# EAGLE design SmartWatch-BASIC-Bottom (EAGLE 9.6.2)
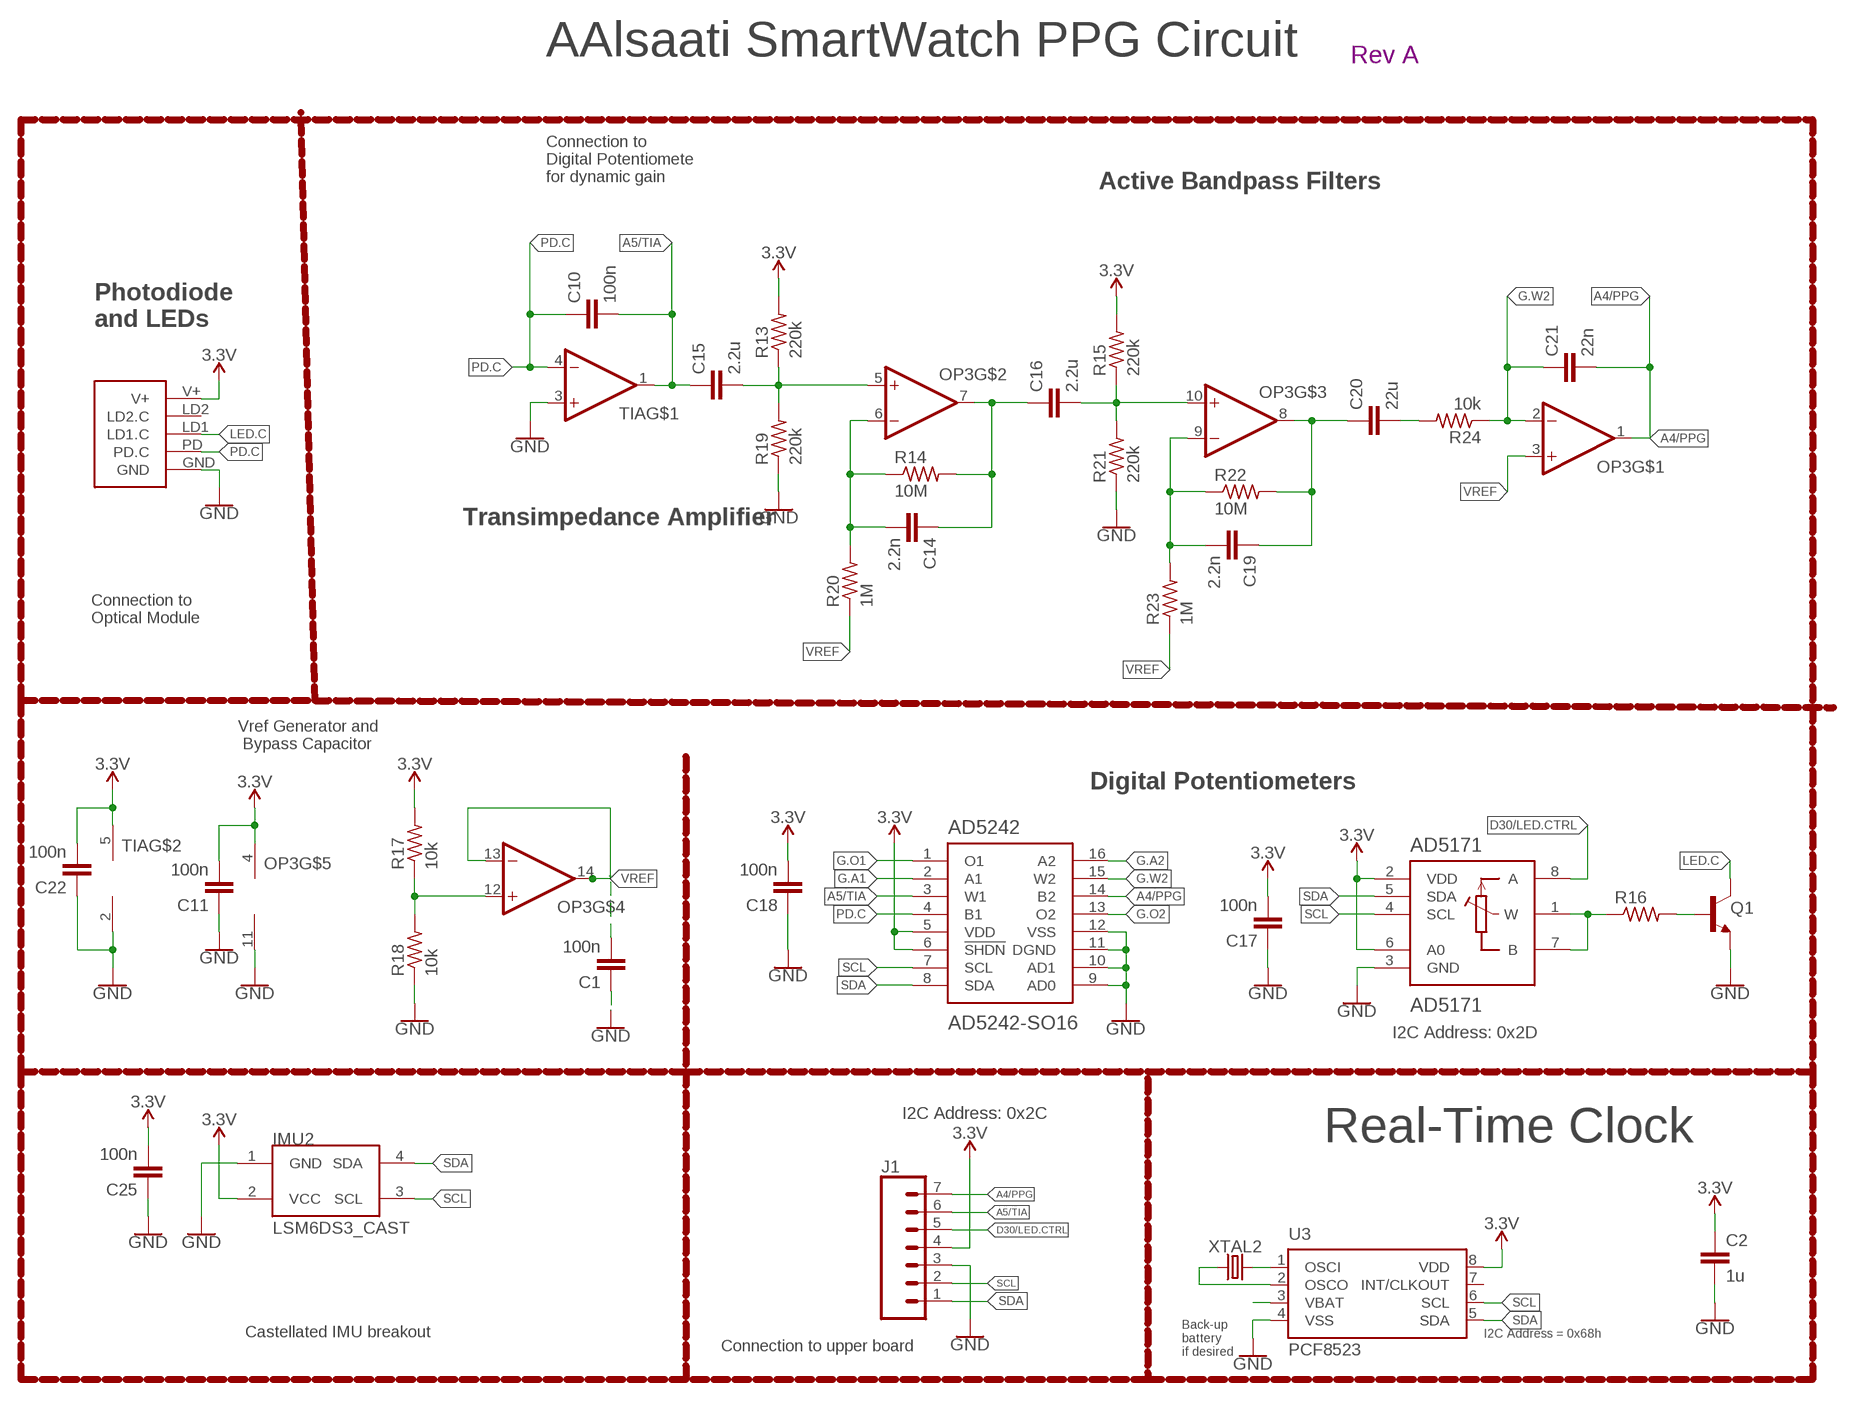
[diagram p0: schematic, sheet 1]

## Parts
AD5171  AD5171  [SOT-23-8]
AD5242  AD5242-SO16  [SO16]
C1  100n  CAPACITOR0603  [C0603]
C2  1u  CAPACITOR0603  [C0603]
C10  100n  CAPACITOR0603  [C0603]
C11  100n  CAPACITOR0603  [C0603]
C14  2.2n  CAPACITOR0603  [C0603]
C15  2.2u  CAPACITOR0603  [C0603]
C16  2.2u  CAPACITOR0603  [C0603]
C17  100n  CAPACITOR0603  [C0603]
C18  100n  CAPACITOR0603  [C0603]
C19  2.2n  CAPACITOR0603  [C0603]
C20  22u  CAPACITOR0603  [C0603]
C21  22n  CAPACITOR0603  [C0603]
C22  100n  CAPACITOR0603  [C0603]
C25  100n  CAPACITOR0603  [C0603]
IMU2  LSM6DS3_CAST  [LSM6DS3_CAST]
J1  CONN_07-1.27MM  [1X07_1.27MM]
LOGO1  REVISION.A  [REV.A]
OP3  OP-QUAD-SO14  [SO14]
Q1  NPN-GENERIC  [SOT23-3]
R13  220k  RESISTOR0603  [R0603]
R14  10M  RESISTOR0603  [R0603]
R15  220k  RESISTOR0603  [R0603]
R16  RESISTOR0603  [R0603]
R17  10k  RESISTOR0402  [R0402]
R18  10k  RESISTOR0402  [R0402]
R19  220k  RESISTOR0603  [R0603]
R20  1M  RESISTOR0603  [R0603]
R21  220k  RESISTOR0603  [R0603]
R22  10M  RESISTOR0603  [R0603]
R23  1M  RESISTOR0603  [R0603]
R24  10k  RESISTOR0603  [R0603]
TIA  OP-SINGLEOT  [SOT23-5]
U3  PCF8523  [SO8]
U$3  PPG.MODULE.2  [PPG.MODULE.2]
XTAL2  32.7680kHz  CRYSTALECS-.327-12.5-12-C-TR  [2-SMD.NOLEAD.2.0MMTO1.2MM]

## Nets
3.3V: AD5171.2(VDD) AD5171.6(A0) AD5242.5(VDD) AD5242.6(!SHDN) C2.1 C11.2 C17.2 C18.2 C22.2 C25.2 IMU2.2(VCC) J1.4 OP3.4(V+) R13.2 R15.2 R17.2 TIA.5(V+) U3.8(VDD) U$3.V+
A4/PPG: AD5242.14(B2) C21.2 J1.7 OP3.1(OUT)
A5/TIA: AD5242.3(W1) C10.2 C15.1 J1.6 TIA.1(OUT)
D30/LED.CTRL: AD5171.8(A) J1.5
G.A1: AD5242.2(A1)
G.A2: AD5242.16(A2)
G.O1: AD5242.1(O1)
G.O2: AD5242.13(O2)
G.W2: AD5242.15(W2) C21.1 OP3.2(-IN) R24.1
GND: AD5171.3(GND) AD5242.9(AD0) AD5242.10(AD1) AD5242.11(DGND) AD5242.12(VSS) C1.1 C2.2 C11.1 C17.1 C18.1 C22.1 C25.1 IMU2.1(GND) J1.3 OP3.11(V-) Q1.2(E) R18.1 R19.1 R21.1 TIA.2(V-) TIA.3(+IN) U3.4(VSS) U$3.GND
LED.C: Q1.3(C) U$3.LD1(LD1.C)
N$2: U3.2(OSCO) XTAL2.P$1
N$3: U3.1(OSCI) XTAL2.P$2
N$8: Q1.1(B) R16.2
N$9: AD5171.1(W) AD5171.7(B) R16.1
N$10: OP3.12(+IN) R17.1 R18.2
N$13: C15.2 OP3.5(+IN) R13.1 R19.2
N$15: C14.2 OP3.6(-IN) R14.1 R20.2
N$16: C14.1 C16.1 OP3.7(OUT) R14.2
N$17: C16.2 OP3.10(+IN) R15.1 R21.2
N$18: C19.2 OP3.9(-IN) R22.1 R23.2
N$19: C19.1 C20.1 OP3.8(OUT) R22.2
N$20: C20.2 R24.2
PD.C: AD5242.4(B1) C10.1 TIA.4(-IN) U$3.PD(PD.C)
SCL: AD5171.4(SCL) AD5242.7(SCL) IMU2.3(SCL) J1.2 U3.6(SCL)
SDA: AD5171.5(SDA) AD5242.8(SDA) IMU2.4(SDA) J1.1 U3.5(SDA)
VBATT: U3.3(VBAT)
VREF: C1.2 OP3.3(+IN) OP3.13(-IN) OP3.14(OUT) R20.1 R23.1
Unconnected: U3.7(INT/CLKOUT) U$3.LD2(LD2.C)

## Notes on the sheet
- AAlsaati SmartWatch PPG Circuit
- Connection to
  Digital Potentiomete
  for dynamic gain
- Active Bandpass Filters
- Photodiode
  and LEDs
- Transimpedance Amplifier
- Connection to
  Optical Module
- Vref Generator and
   Bypass Capacitor
- Digital Potentiometers
- I2C Address: 0x2D
- I2C Address: 0x2C
- Real-Time Clock
- Castellated IMU breakout | I2C Address = 0x68h
- Connection to upper board
- Back-up
  battery
  if desired

## Library data of the parts
AD5171 = LinnesLab-DigitalIC:AD5171
AD5242 = LinnesLab-DigitalIC:AD5242
C1 C2 C10 C11 C14-C22 C25 = LinnesLab-Passives:CAPACITOR
IMU2 = LinnesLab-Sensors:LSM6DS3_CAST
J1 = LinnesLab-Connectors:CONN_07: Multi connection point. Often used as Generic Header-pin footprint for 0.1 inch spaced/style header connections On any of the 0.1 inch spaced packages, you can populate with these: Break Away Headers - Straight <https://www.sparkfun.com/products/116> (PRT-00116) Break Away Male Headers - Right Angle <https://www.sparkfun.com/products/553> (PRT-00553) Female Headers <https://www.sparkfun.com/products/115> (PRT-00115) Break Away Headers - Machine Pin <https://www.sparkfun.com/products/117> (PRT-00117) Break Away Female Headers - Swiss Machine Pin <https://www.sparkfun.com/products/743> (PRT-00743) For SCREWTERMINALS and SPRING TERMINALS visit here: Screw Terimnals on SparkFun.com <https://www.sparkfun.com/search/results?term=Screw+Terminals> (5mm/3.5mm/2.54mm spacing) This device is also useful as a general connection point to wire up your design to another part of your project. Our various solder wires solder well into these plated through hole pads. Hook-Up Wire - Assortment (Stranded, 22 AWG) <https://www.sparkfun.com/products/11375> (PRT-11375) Hook-Up Wire - Assortment (Solid Core, 22 AWG) <https://www.sparkfun.com/products/11367> (PRT-11367) View the entire wire category on our website here <https://www.sparkfun.com/categories/141> Special notes: Molex polarized connector foot print use with SKU : PRT-08231 with associated crimp pins and housings. 1MM SMD Version SKU: PRT-10208 NOTES ON THE VARIANTS LOCK and LOCK_LONGPADS... This footprint was designed to help hold the alignment of a through-hole component (i.e. 6-pin header) while soldering it into place. You may notice that each hole has been shifted either up or down by 0.005 of an inch from it's more standard position (which is a perfectly straight line). This slight alteration caused the pins (the squares in the middle) to touch the edges of the holes. Because they are alternating, it causes a "brace" to hold the component in place. 0.005 has proven to be the perfect amount of "off-center" position when using our standard breakaway headers. Although looks a little odd when you look at the bare footprint, once you have a header in there, the alteration is very hard to notice. Also,if you push a header all the way into place, it is covered up entirely on the bottom side.
LOGO1 = LinnesLab-Logos:REVISION.A
OP3 = LinnesLab-AnalogIC:OP-QUAD: General symbol and footprints for Quad Op Amps. Use with any standard general purpose op amp.
Q1 = LinnesLab-DiscreteSemi:NPN
R13-R24 = LinnesLab-Passives:RESISTOR
TIA = LinnesLab-AnalogIC:OP-SINGLE: Single Op Amp 2.7V to 6.0V Single Supply CMOS Source: http://ww1.microchip.com/downloads/en/DeviceDoc/21314g.pdf
U3 = LinnesLab-Clocks:PCF8523; DIGIKEY: 568-5306-1-ND; I2C_ADDRESS: 0x68h; MFN: PCF8523T/1,118; MFN_MANUFACTURER: NXP USA Inc.
U$3 = LinnesLab-Connectors:PPG.MODULE.2: Digi-Key Part Number: S9014E-50-ND Manufacturer Part Number: GRPB501VWVN-RC Description: 1mm insulation height 0.05in pitch 50 positions
XTAL2 = LinnesLab-Clocks:CRYSTAL; DIGIKEY: XC2288CT-ND; FREQ: 32.7680KHZ; LOAD_CAP: 12.5pF

## Board
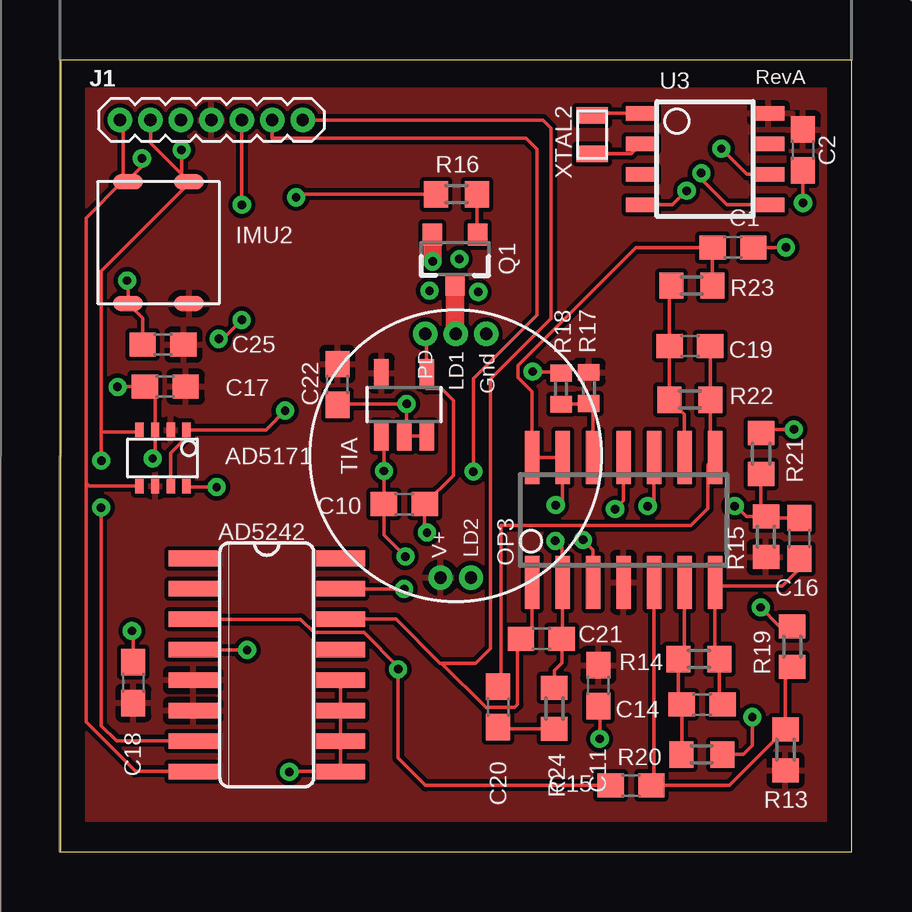
[diagram p1: board, top side]
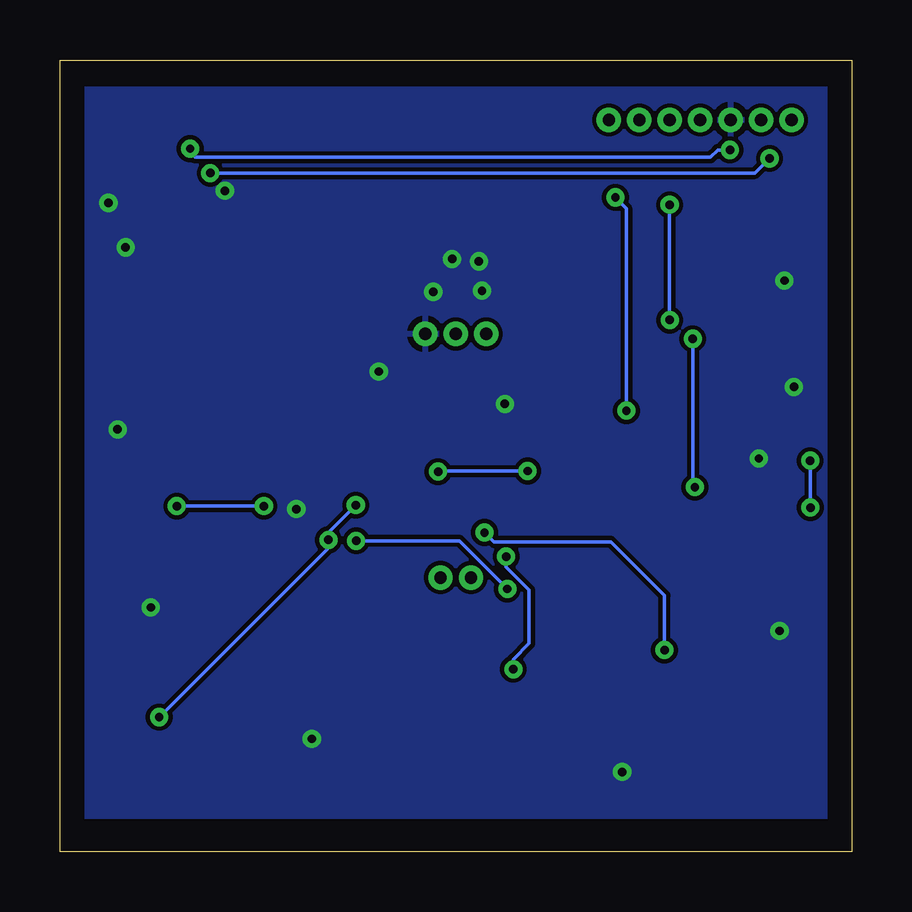
[diagram p2: board, bottom side, seen from below]

Size 33 x 33 mm. Coordinates in mm from the lower left corner, seen from the top.
Outline: 0,0 33,0 33,33 0,33 0,0
Copper layers (1*16): Top 0.035mm / dielectric 1.5mm / Bottom 0.035mm
Design rules "default": minimum track width 6mil, minimum drill 0.35mm, track to track 6mil, track to pad 6mil, pad to pad 6mil, via to via 6mil, smd to smd 6mil, copper to edge 40mil, drill to drill 6mil, minimum pad ring 10mil, minimum via ring 8mil, stop-mask expansion 4mil, vias tented up to drill 0mil, thermal gap 10mil

### Footprints (pad centres in the part's own frame; a part is rotated, then mirrored left to right if it is on the bottom)
SOT-23-8 = smd 0.35 x 0.6: 1 -0.991,-1.176; 2 -0.341,-1.176; 3 0.309,-1.176; 4 0.959,-1.176; 5 0.959,1.176; 6 0.309,1.176; 7 -0.341,1.176; 8 -0.991,1.176
SO16 = smd 0.66 x 2.032: 1 -4.445,-3.073; 2 -3.175,-3.073; 3 -1.905,-3.073; 4 -0.635,-3.073; 5 0.635,-3.073; 6 1.905,-3.073; 7 3.175,-3.073; 8 4.445,-3.073; 9 4.445,3.073; 10 3.175,3.073; 11 1.905,3.073; 12 0.635,3.073; 13 -0.635,3.073; 14 -1.905,3.073; 15 -3.175,3.073; 16 -4.445,3.073
C0603 = smd 1.1 x 1: 1 -0.85,0; 2 0.85,0
LSM6DS3_CAST = smd 0.635 x 1.27: 1 -2.54,1.27; 2 -2.54,-1.27; 3 2.54,-1.27; 4 2.54,1.27
1X07_1.27MM = drill 0.508 pad 1: 1 0,0; 2 1.27,0; 3 2.54,0; 4 3.81,0; 5 5.08,0; 6 6.35,0; 7 7.62,0
SO14 = smd 0.6 x 2.2: 1 -3.81,-2.6; 2 -2.54,-2.6; 3 -1.27,-2.6; 4 0,-2.6; 5 1.27,-2.6; 6 2.54,-2.6; 7 3.81,-2.6; 8 3.81,2.6; 9 2.54,2.6; 10 1.27,2.6; 11 0,2.6; 12 -1.27,2.6; 13 -2.54,2.6; 14 -3.81,2.6
SOT23-3 = smd 0.8 x 0.9: 1 -0.95,-1; 2 0.95,-1; 3 0,1.1
R0603 = smd 1 x 1.1: 1 -0.85,0; 2 0.85,0
R0402 = smd 0.7 x 0.9: 1 -0.65,0; 2 0.65,0
SOT23-5 = smd 0.6 x 1.2: 1 -0.95,-1.306; 2 0,-1.306; 3 0.95,-1.306; 4 0.95,1.306; 5 -0.95,1.306
SO8 = smd 1.3 x 0.6: 1 -2.65,1.905; 2 -2.65,0.635; 3 -2.65,-0.635; 4 -2.65,-1.905; 5 2.65,-1.905; 6 2.65,-0.635; 7 2.65,0.635; 8 2.65,1.905
PPG.MODULE.2 = drill 0.508 pad 0.94: GND 1.27,5.08; LD1 0,5.08; LD2 0.635,-5.08; PD -1.27,5.08; V+ -0.635,-5.08
2-SMD.NOLEAD.2.0MMTO1.2MM = smd 0.7 x 1.3: P$1 -0.8,0; P$2 0.8,0

### Placement (x,y rotation side)
AD5171  4.28,16.41 180 top
AD5242  8.62,7.78 270 top
C1  28.06,25.19 180 top
C2  30.98,29.25 270 top
C10  14.36,14.49 180 top
C11  22.45,6.92 90 top
C14  26.77,6.13 180 top
C15  23.8,2.75 0 top
C16  30.83,13.06 90 top
C17  4.39,19.38 0 top
C18  3.06,7.04 270 top
C19  26.26,21.08 180 top
C20  18.27,6.03 270 top
C21  20.07,8.87 180 top
C22  11.56,19.47 90 top
C25  4.3,21.13 0 top
IMU2  4.11,25.39 90 top
J1  2.5,30.5 0 top
LOGO1  29,31.99 0 top
OP3  23.5,13.82 0 top
Q1  16.47,24.72 180 top
R13  30.25,4.25 270 top
R14  26.64,8.03 0 top
R15  29.43,13.12 270 top
R16  16.53,27.4 0 top
R17  22.05,19.33 90 top
R18  20.89,19.3 270 top
R19  30.53,8.54 270 top
R20  26.75,4.05 180 top
R21  29.23,16.59 270 top
R22  26.26,18.84 0 top
R23  26.34,23.59 180 top
R24  20.61,5.97 270 top
TIA  14.35,18.63 0 top
U3  26.89,28.87 0 top
U$3  16.5,16.5 0 top
XTAL2  22.19,29.88 90 top

### Tracks (layer width: path | path; a pad name or v marks a point on that pad's centre or on a via)
3.3V
  pour Top (isolate 0.178): 1.09,31.79 32.63,31.79 32.63,1.31 1.09,1.31
A4/PPG
  Top 0.152: OP3.1 19.69,9.34 C21.2 19.08,8.74 19.08,6.13 18.95,6 17.75,6 15.9,7.85 | 15.9,7.85 17.33,7.85 17.95,8.47 17.95,19.7 20.46,22.21 20.46,30.16 20.13,30.5 J1.7 | 15.9,7.85 15.85,7.85 14,9.7 AD5242.14
A5/TIA  (via drill 0.35)
  Top 0.152: TIA.1 13.5,17.22 v13.5,15.86 C10.2 13.5,13.2 v14.4,12.3 | C15.1 15.25,2.75 14.1,3.9 v14.1,7.6 14.1,7.7 12.67,9.13 10.58,9.13 10.03,9.69 AD5242.3 | v17.24,15.84 17.24,19.73 19.88,22.37 19.88,29.27 19.42,29.73 8.85,29.73 J1.6
  Bottom 0.152: v14.4,12.3 14.4,11.86 13.44,10.9 13.44,8.68 14.1,8.01 v14.1,7.6 | v17.24,15.84 17.21,15.86 v13.5,15.86
D30/LED.CTRL  (via drill 0.35)
  Top 0.152: v6.62,21.38 6.67,21.32 6.75,21.32 v7.58,22.16 | v6.53,15.19 5.31,15.19 AD5171.8 | J1.5 7.58,27.12 7.66,27.04 v7.58,26.96
  Bottom 0.152: v6.62,21.38 6.62,15.3 6.52,15.2 v6.53,15.19 | v7.58,26.96 7.58,22.21 7.53,22.16 7.54,22.16 v7.58,22.16
G.W2  (via drill 0.35)
  Top 0.152: AD5242.15 14.26,10.96 14.3,11 v14.35,10.95 | R24.1 20.61,7.55 20.92,7.86 C21.1 20.96,8.91 OP3.2 20.93,11.25 20.93,12.68 v20.65,12.95
  Bottom 0.152: v14.35,10.95 16.35,12.95 v20.65,12.95
GND  (via drill 0.35)
  Top 0.152: R18.1 20.84,20 19.69,20 v19.71,20.01 | OP3.11 23.5,14.63 v23.14,14.27 | R21.1 29.39,17.6 v30.6,17.6 | v29.21,10.18 30,9.39 R19.1 | C11.1 22.5,6.02 v22.5,4.7 | C18.1 3.06,9.14 v3,9.2 | C22.1 11.6,18.66 v14.45,18.66 14.45,17.43 TIA.2 TIA.3 | AD5242.12 AD5242.11 AD5242.10 AD5242.9 9.6,3.34 9.59,3.34 v9.56,3.32 | v2.8,23.8 2.84,23.76 IMU2.1 3.45,22.23 C25.1 3.54,21.04 | v3.86,16.39 3.76,16.49 3.97,16.69 AD5171.3 3.97,18.95 C17.1 v2.41,19.38 v2.4,19.37 | C1.1 v30.27,25.19 | C2.2 v30.98,27.04 | U3.4 25.54,26.96 v26.13,27.55
  Top 0.762: Q1.2 15.53,25.7 v15.53,24.6
  other vias: 15.41,23.38 17.44,23.33 16.65,24.7
  pour Bottom (isolate 0.178): 0.86,31.82 32.22,31.82 32.22,1.42 0.87,1.42 0.87,31.81 0.88,31.81
LED.C
  Top 0.762: Q1.3 16.47,21.61 U$3.LD1
N$2
  Top 0.152: U3.2 23.82,29.09 XTAL2.P$1
N$3
  Top 0.152: XTAL2.P$2 22.28,30.77 U3.1
N$8
  Top 0.152: R16.2 17.38,25.76 Q1.1
N$9  (via drill 0.35)
  Top 0.152: AD5171.7 4.62,16.61 5.27,17.26 AD5171.1 8.59,17.58 v9.39,18.38 | R16.1 9.98,27.4 v9.84,27.27
  Bottom 0.152: v9.84,27.27 9.39,26.81 v9.39,18.38
N$10
  Top 0.152: R18.2 22.02,18.65 R17.1 22.23,18.5 OP3.12
N$13
  Top 0.152: R19.2 30.25,7.42 R13.1 27.91,2.75 C15.2 24.77,2.86 OP3.5
N$15
  Top 0.152: OP3.6 26.04,8.27 R14.1 25.79,6.26 C14.2 25.92,4.06 R20.2
N$16
  Top 0.152: C14.1 27.49,6.26 R14.2 27.31,8.21 OP3.7 27.47,11.06 30.11,11.06 30.83,11.78 C16.1
N$17  (via drill 0.35)
  Top 0.152: R21.2 29.23,14.18 R15.1 | R15.1 29.5,13.91 C16.2 | R15.1 28.61,13.97 28.18,14.4 v28.13,14.4 | OP3.10 24.77,14.67 v24.5,14.4
  Bottom 0.152: v28.13,14.4 v24.5,14.4
N$18
  Top 0.152: OP3.9 26.04,18.22 R22.1 C19.2 25.41,23.52 R23.2
N$19
  Top 0.152: C20.1 18.39,7 18.39,13.6 26.3,13.6 27,14.3 27,16.12 OP3.8 27.11,16.62 R22.2 C19.1
N$20
  Top 0.152: R24.2 18.33,5.12 C20.2
PD.C  (via drill 0.35)
  Top 0.152: U$3.PD 15.27,21.54 15.27,19.3 15.3,19.3 | 15.3,19.3 TIA.4 | 15.3,19.3 15.9,19.3 16.4,18.8 16.4,15.68 C10.1 15.2,13.39 v15.3,13.3 | AD5242.4 7.68,8.42 7.7,8.4 v7.8,8.4
  Bottom 0.152: v7.8,8.4 7.8,10.67 10.03,12.91 14.65,12.91 14.66,12.9 14.9,12.9 v15.3,13.3
SCL  (via drill 0.35)
  Top 0.152: J1.2 3.78,29.52 IMU2.3 | AD5242.7 2.36,4.61 1.72,5.25 v1.72,14.34 | v1.72,16.3 1.72,17.49 | 1.72,17.49 1.72,24.2 5.38,27.86 IMU2.3 | AD5171.4 3.23,17.49 1.72,17.49 | U3.6 28.64,28.23 v27.57,29.3 | v5.07,29.25 5.07,28.23 IMU2.3
  Bottom 0.152: v1.72,16.3 v1.72,14.35 v1.72,14.34 | v5.07,29.25 5.58,29.25 5.88,28.95 27.37,28.95 27.55,29.12 27.55,29.27 v27.57,29.3
SDA  (via drill 0.35)
  Top 0.152: J1.1 2.64,30.36 2.64,28.12 2.79,27.97 | 2.79,27.97 2.81,27.95 | 2.81,27.95 IMU2.4 | AD5242.8 3.16,3.34 1.09,5.4 1.09,15.36 | 1.09,15.36 1.09,26.42 2.64,27.97 2.79,27.97 | AD5171.5 1.22,15.23 1.09,15.36 | U3.5 27.8,26.96 26.61,28.16 v26.73,28.29 | v3.42,28.89 3.42,28.56 2.81,27.95
  Bottom 0.152: v26.73,28.29 4.03,28.29 v3.42,28.89
VREF  (via drill 0.35)
  Top 0.152: OP3.14 OP3.13 20.94,16.41 20.94,14.72 v20.66,14.44 | OP3.14 19.67,16.44 | R20.1 28.48,4.05 28.86,4.43 v28.86,5.6 | v21.81,12.99 22.23,12.57 OP3.3 | R23.1 27.19,25.17 C1.2 24.02,25.19 20.36,21.53 20.36,21.52 19.1,20.26 19.1,19.76 19.69,19.18 OP3.14
  Bottom 0.152: v28.86,5.6 21.83,12.63 21.83,13.15 | 21.83,13.15 21.81,13.12 v21.81,12.99 | v20.66,14.44 21.83,13.27 21.83,13.15